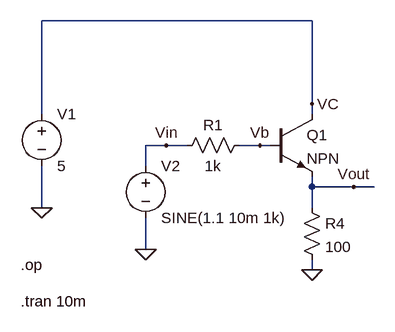
[diagram p0: schematic emitter_follower.asc]
emitter_follower.asc, the LTspice schematic file:
Version 4
SHEET 1 880 680
WIRE 320 -32 -96 -32
WIRE 320 96 320 -32
WIRE -96 112 -96 -32
WIRE 320 112 320 96
WIRE 96 160 64 160
WIRE 128 160 96 160
WIRE 240 160 208 160
WIRE 256 160 240 160
WIRE 64 192 64 160
WIRE 320 224 320 208
WIRE 384 224 320 224
WIRE 416 224 384 224
WIRE -96 256 -96 192
WIRE 320 256 320 224
WIRE 64 320 64 272
WIRE 320 352 320 336
FLAG 64 320 0
FLAG 320 352 0
FLAG -96 256 0
FLAG 320 96 VC
FLAG 384 224 Vout
FLAG 96 160 Vin
FLAG 240 160 Vb
SYMBOL res 304 240 R0
SYMATTR InstName R4
SYMATTR Value 100
SYMBOL voltage -96 96 R0
WINDOW 123 0 0 Left 0
WINDOW 39 0 0 Left 0
SYMATTR InstName V1
SYMATTR Value 5
SYMBOL npn 256 112 R0
SYMATTR InstName Q1
SYMBOL voltage 64 176 R0
WINDOW 123 0 0 Left 0
WINDOW 39 24 124 Left 2
SYMATTR InstName V2
SYMATTR Value SINE(1.1 10m 1k)
SYMBOL res 224 144 R90
WINDOW 0 0 56 VBottom 2
WINDOW 3 32 56 VTop 2
SYMATTR InstName R1
SYMATTR Value 1k
TEXT -128 344 Left 2 !.op
TEXT -128 400 Left 2 !.tran 10m

The netlist it stands for:
* emitter_follower.asc
R4 Vout 0 100
V1 VC 0 5
Q1 VC Vb Vout 0 NPN
V2 Vin 0 SINE(1.1 10m 1k)
R1 Vb Vin 1k
.model NPN NPN
.model PNP PNP
.lib standard.bjt
.op
.tran 10m
.backanno
.end